# Altium schematic sheet Sheet1.SchDoc
size A4; SheetNumber: 1; SheetTotal: 1
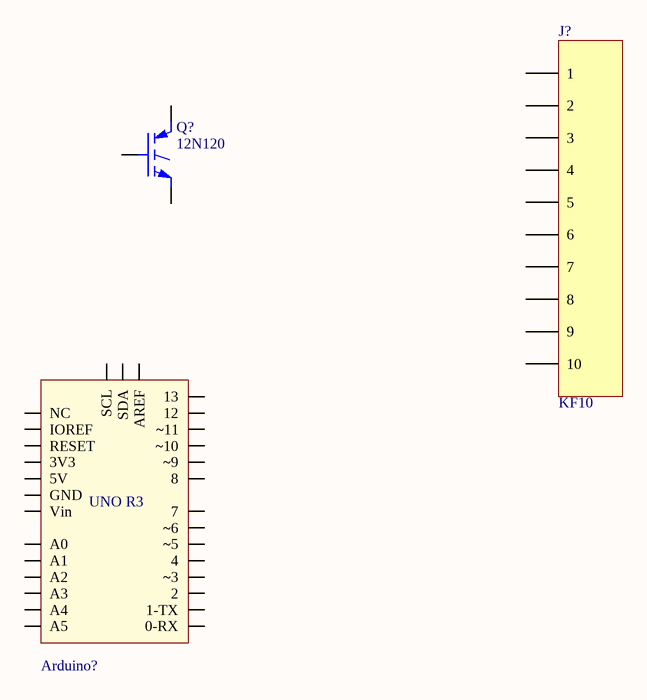
[diagram p0: Sheet1.SchDoc]

## Parts
Arduino?  Arduino Uno R3  [Arduino UNO R3]  (value not drawn)
J?  KF10  [KF10-10]
Q?  12N120  [TO247]

## Nets

Not connected (* = marked no-connect by the designer): Arduino? 0-RX 1-TX 2 3V3 4 5V 7 8 12 13 A0 A1 A2 A3 A4 A5 AREF GND IOREF NC RESET SCL SDA Vin ~3 ~5 ~6 ~9 ~10 ~11; J? 1 2 3 4 5 6 7 8 9 10; Q? 1(G) 2(C) 3(E)

## Notes on the sheet
- (in symbol Arduino Uno R3) UNO R3

## Library data of the parts
Arduino? = Arduino Uno R3: Value: Cau 1A
J? = KF10: Manufacturer: W¨¹rth Elektronik eiSos GmbH; PartNo: 691133710010; ComponentLink1 Description: Manufacturer; ComponentLink2 Description: Datasheet; NoPins: 10; ComponentLink1 URL: http://www.we-online.com; ComponentLink2 URL: http://katalog.we-online.de/em/datasheet/6911337100xx.pdf; Created By: Baojun Chen; Created Date: 4-Aug-15
Q? = 12N120: Insulated Gate Bipolar Transistor; Note: Pin 2 is internally connected to Pin 4 (BASE); Published: 29-Sep-2000; LatestRevisionDate: 17-Jul-2002; LatestRevisionNote: Re-released for DXP Platform.; DatasheetVersion: 1996; PackageVersion: 1996; PackageReference: 340F-03; Publisher: Altium Limited; PackageDescription: SIP with Mounting Hole; 3 Leads; Body 20.7 x 15.7 x 5 mm (typ); Pitch 5.45 mm; ComponentLink1Description: Manufacturer Link; ComponentLink1URL: http://www.onsemi.com/site/products/landing?taxonomyID=194